# EAGLE design usb-wildcard-r2 (EAGLE 5.12)
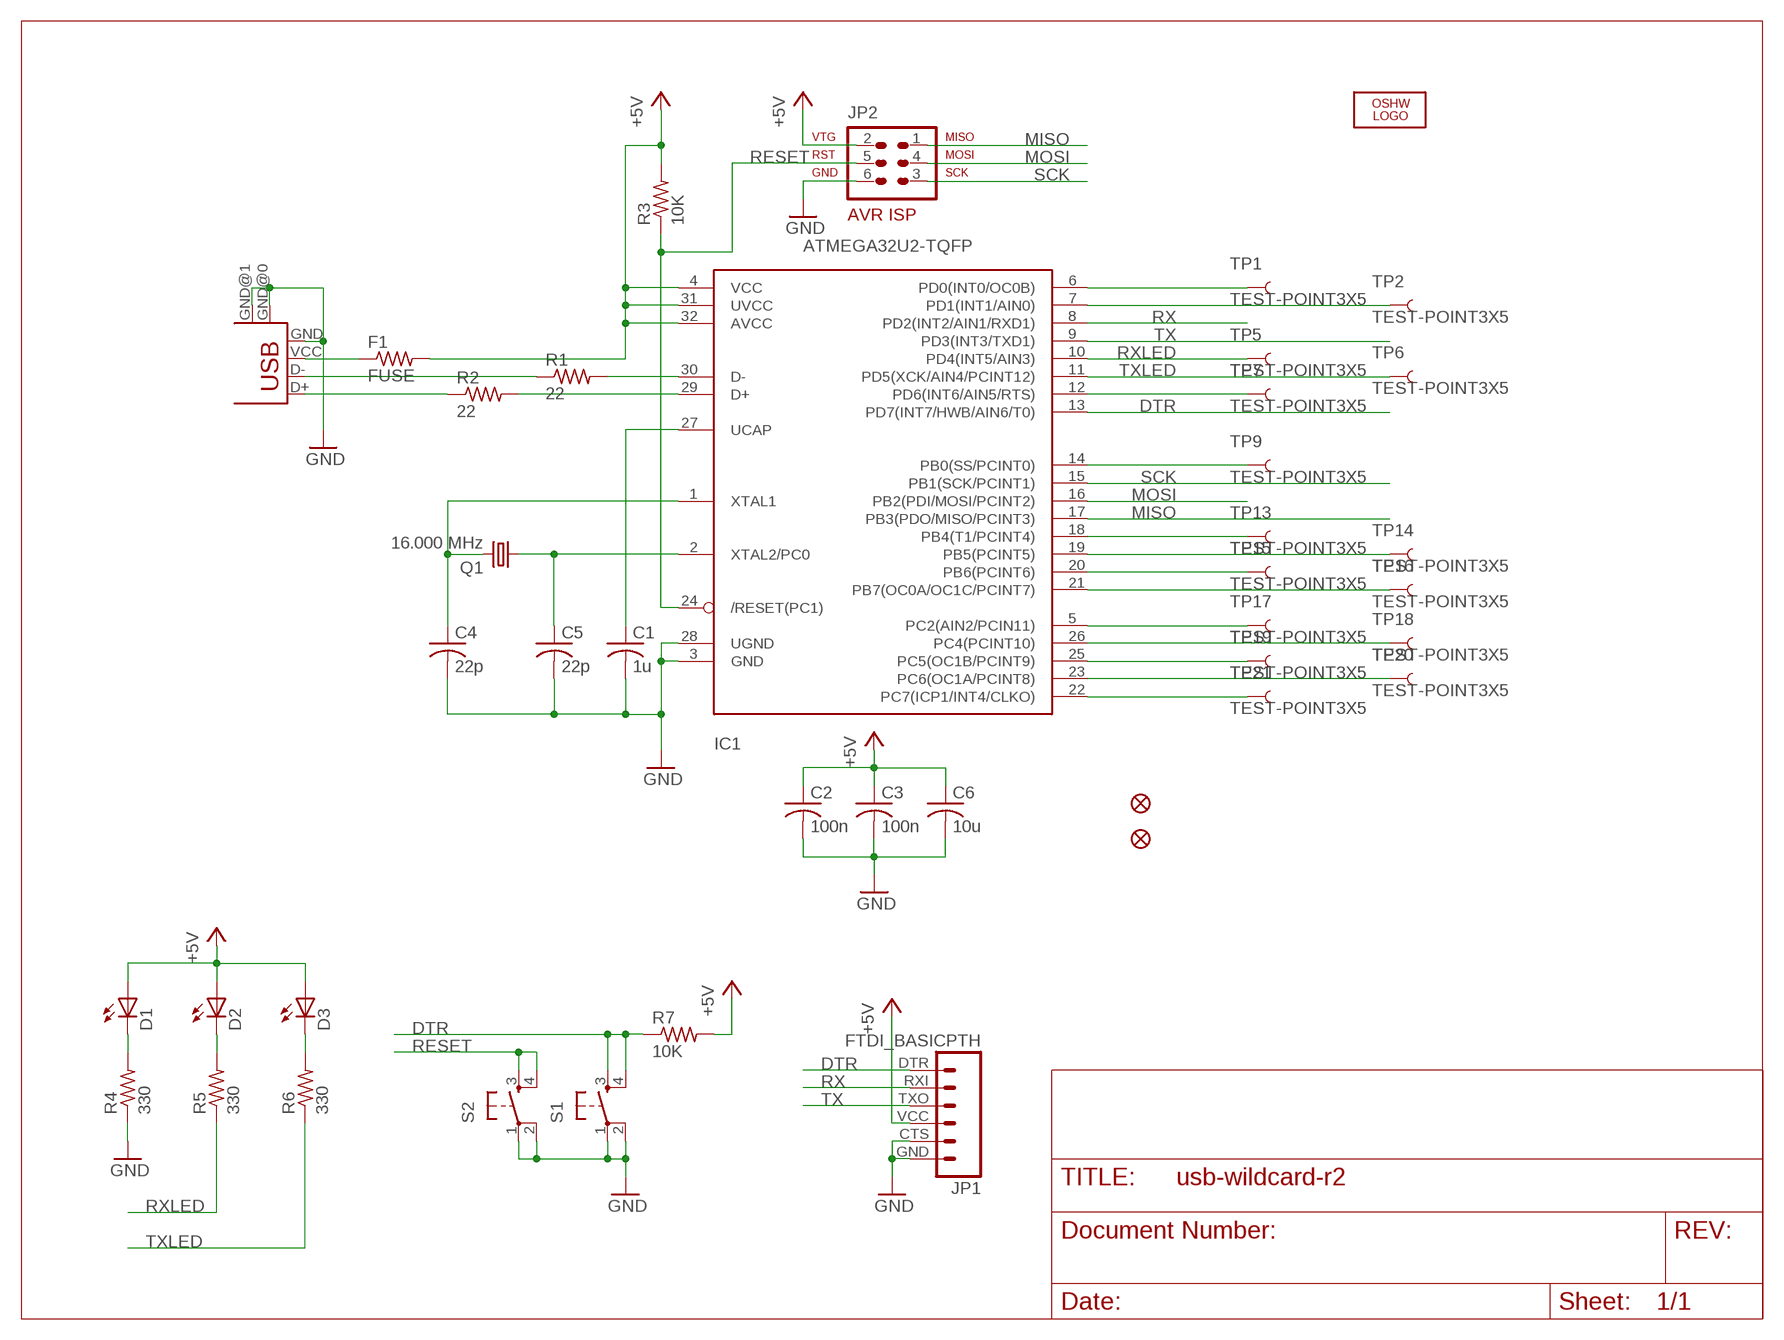
[diagram p0: schematic, sheet 1]

## Parts
C1  1u  C-USC0603  [C0603]
C2  100n  C-USC0603  [C0603]
C3  100n  C-USC0603  [C0603]
C4  22p  C-USC0603  [C0603]
C5  22p  C-USC0603  [C0603]
C6  10u  C-USC0603  [C0603]
D1  LEDCHIP-LED0603  [CHIP-LED0603]
D2  LEDCHIP-LED0603  [CHIP-LED0603]
D3  LEDCHIP-LED0603  [CHIP-LED0603]
F1  FUSE  R-US_R0603  [R0603]
IC1  ATMEGA32U2-TQFP  [TQFP32-08]
JP1  FTDI_BASICPTH  [FTDI_BASIC]
JP2  AVR-ISP-6  [AVR-ISP-6]
JP3  FIDUCIAL1X2.5  [FIDUCIAL-1X2.5]
JP4  FIDUCIAL1X2.5  [FIDUCIAL-1X2.5]
LOGO1  OSHW_LOGO_10MILX0200-NT  [OSHW_10X200_NOTEXT]
Q1  16.000 MHz  CRYSTALCTS406  [CTS406]
R1  22  R-US_R0603  [R0603]
R2  22  R-US_R0603  [R0603]
R3  10K  R-US_R0603  [R0603]
R4  330  R-US_R0603  [R0603]
R5  330  R-US_R0603  [R0603]
R6  330  R-US_R0603  [R0603]
R7  10K  R-US_R0603  [R0603]
S1  TAC_SWITCHSMD  [TACTILE_SWITCH_SMD]
S2  TAC_SWITCHSMD  [TACTILE_SWITCH_SMD]
TP1  TEST-POINT3X5  [PAD.03X.05]
TP2  TEST-POINT3X5  [PAD.03X.05]
TP5  TEST-POINT3X5  [PAD.03X.05]
TP6  TEST-POINT3X5  [PAD.03X.05]
TP7  TEST-POINT3X5  [PAD.03X.05]
TP9  TEST-POINT3X5  [PAD.03X.05]
TP13  TEST-POINT3X5  [PAD.03X.05]
TP14  TEST-POINT3X5  [PAD.03X.05]
TP15  TEST-POINT3X5  [PAD.03X.05]
TP16  TEST-POINT3X5  [PAD.03X.05]
TP17  TEST-POINT3X5  [PAD.03X.05]
TP18  TEST-POINT3X5  [PAD.03X.05]
TP19  TEST-POINT3X5  [PAD.03X.05]
TP20  TEST-POINT3X5  [PAD.03X.05]
TP21  TEST-POINT3X5  [PAD.03X.05]
USB1  USB-U  [USB-MICROB-ALI]

## Nets
+5V: C2.1 C3.1 C6.1 D1.A D2.A D3.A F1.2 IC1.4(VCC) IC1.31(UVCC) IC1.32(AVCC) JP1.VCC JP2.2 R3.2 R7.2
D+: R2.1 USB1.D+
D-: R1.1 USB1.D-
DTR: IC1.13(PD7(INT7/HWB/AIN6/T0)) JP1.DTR R7.1 S1.3 S1.4
GND: C1.2 C2.2 C3.2 C4.2 C5.2 C6.2 IC1.3(GND) IC1.28(UGND) JP1.CTS JP1.GND JP2.6 R4.1 S1.1 S1.2 S2.1 S2.2 USB1.GND USB1.GND@0(GND) USB1.GND@1(GND)
MISO: IC1.17(PB3(PDO/MISO/PCINT3)) JP2.1
MOSI: IC1.16(PB2(PDI/MOSI/PCINT2)) JP2.4
N$2: IC1.30(D-) R1.2
N$3: IC1.29(D+) R2.2
N$4: F1.1 USB1.VCC(VBUS)
N$8: C1.1 IC1.27(UCAP)
N$9: C4.1 IC1.1(XTAL1) Q1.3
N$10: C5.1 IC1.2(XTAL2/PC0) Q1.1
N$23: D1.C R4.2
N$24: D2.C R5.2
N$25: D3.C R6.2
PB0: IC1.14(PB0(SS/PCINT0)) TP9.P$1
PB4: IC1.18(PB4(T1/PCINT4)) TP13.P$1
PB5: IC1.19(PB5(PCINT5)) TP14.P$1
PB6: IC1.20(PB6(PCINT6)) TP15.P$1
PB7: IC1.21(PB7(OC0A/OC1C/PCINT7)) TP16.P$1
PC2: IC1.5(PC2(AIN2/PCIN11)) TP17.P$1
PC4: IC1.26(PC4(PCINT10)) TP18.P$1
PC5: IC1.25(PC5(OC1B/PCINT9)) TP19.P$1
PC6: IC1.23(PC6(OC1A/PCINT8)) TP20.P$1
PC7: IC1.22(PC7(ICP1/INT4/CLKO)) TP21.P$1
PD0: IC1.6(PD0(INT0/OC0B)) TP1.P$1
PD1: IC1.7(PD1(INT1/AIN0)) TP2.P$1
PD6: IC1.12(PD6(INT6/AIN5/RTS)) TP7.P$1
RESET: IC1.24(/RESET(PC1)) JP2.5 R3.1 S2.3 S2.4
RX: IC1.8(PD2(INT2/AIN1/RXD1)) JP1.RXI
RXLED: IC1.10(PD4(INT5/AIN3)) R5.1 TP5.P$1
SCK: IC1.15(PB1(SCK/PCINT1)) JP2.3
TX: IC1.9(PD3(INT3/TXD1)) JP1.TXO
TXLED: IC1.11(PD5(XCK/AIN4/PCINT12)) R6.1 TP6.P$1

## Library data of the parts
C1-C6 = rcl:C-US: CAPACITOR, American symbol
D1-D3 = led:LED: LED OSRAM: - CHIPLED LG R971, LG N971, LY N971, LG Q971, LY Q971, LO R971, LY R971 LH N974, LH R974 LS Q976, LO Q976, LY Q976 LO Q996 - Hyper CHIPLED LW Q18S LB Q993, LB Q99A, LB R99A - SideLED LS A670, LO A670, LY A670, LG A670, LP A670 LB A673, LV A673, LT A673, LW A673 LH A674 LY A675 LS A676, LA A676, LO A676, LY A676, LW A676 LS A679, LY A679, LG A679 - Hyper Micro SIDELED® LS Y876, LA Y876, LO Y876, LY Y876 LT Y87S - SmartLED LW L88C, LW L88S LB L89C, LB L89S, LG L890 LS L89K, LO L89K, LY L89K LS L896, LA L896, LO L896, LY L896 - TOPLED LS T670, LO T670, LY T670, LG T670, LP T670 LSG T670, LSP T670, LSY T670, LOP T670, LYG T670 LG T671, LOG T671, LSG T671 LB T673, LV T673, LT T673, LW T673 LH T674 LS T676, LA T676, LO T676, LY T676, LB T676, LH T676, LSB T676, LW T676 LB T67C, LV T67C, LT T67C, LS T67K, LO T67K, LY T67K, LW E67C LS E67B, LA E67B, LO E67B, LY E67B, LB E67C, LV E67C, LT E67C LW T67C LS T679, LY T679, LG T679 LS T770, LO T770, LY T770, LG T770, LP T770 LB T773, LV T773, LT T773, LW T773 LH T774 LS E675, LA E675, LY E675, LS T675 LS T776, LA T776, LO T776, LY T776, LB T776 LHGB T686 LT T68C, LB T68C - Hyper Mini TOPLED® LB M676 - Mini TOPLED Santana® LG M470 LS M47K, LO M47K, LY M47K Source: http://www.osram.convergy.de LUXEON: - LUMILED® LXK2-PW12-R00, LXK2-PW12-S00, LXK2-PW14-U00, LXK2-PW14-V00 LXK2-PM12-R00, LXK2-PM12-S00, LXK2-PM14-U00 LXK2-PE12-Q00, LXK2-PE12-R00, LXK2-PE12-S00, LXK2-PE14-T00, LXK2-PE14-U00 LXK2-PB12-K00, LXK2-PB12-L00, LXK2-PB12-M00, LXK2-PB14-N00, LXK2-PB14-P00, LXK2-PB14-Q00 LXK2-PR12-L00, LXK2-PR12-M00, LXK2-PR14-Q00, LXK2-PR14-R00 LXK2-PD12-Q00, LXK2-PD12-R00, LXK2-PD12-S00 LXK2-PH12-R00, LXK2-PH12-S00 LXK2-PL12-P00, LXK2-PL12-Q00, LXK2-PL12-R00 Source: www.luxeon.com KINGBRIGHT: KA-3528ASYC Source: www.kingbright.com
F1 R1-R7 = rcl:R-US_: RESISTOR, American symbol
IC1 = adafruit:ATMEGA32U2: ATmega32u2 Pin compatible with the atmega8u2, atmega16u2 and atmega32u2 8, 16 or 32 K flash, 1K RAM, 512b EEPROM 8 bit and 16 bit timer (5 PWM total) UART, SPI (no I2C!) USB with 4 endpoints, LUFA compatible 22 I/O lines, analog comparator (no ADC!) Comes with DFU bootloader burned in!
JP1 = SparkFun:FTDI_BASIC: FTDI Basic: 3.3V and 5V
JP2 = avr-5:AVR-ISP-6: AVR ISP-6 Serial Programming Header
JP3 JP4 = SparkFun:FIDUCIAL: Fiducial Alignment Points Various fiducial points for machine vision alignment.
LOGO1 = ohw-logo:OSHW_LOGO_10MIL
Q1 = crystal:CRYSTAL: CRYSTAL; OC_FARNELL: unknown; OC_NEWARK: unknown
S1 S2 = SparkFun:TAC_SWITCH: Momentary Switch Button commonly used for reset or general input. Spark Fun Electronics SKU : COM-00097
TP1 TP2 TP5-TP7 TP9 TP13-TP21 = SparkFun:TEST-POINT
USB1 = con-usb-2:USB: USB Connectors

## Board
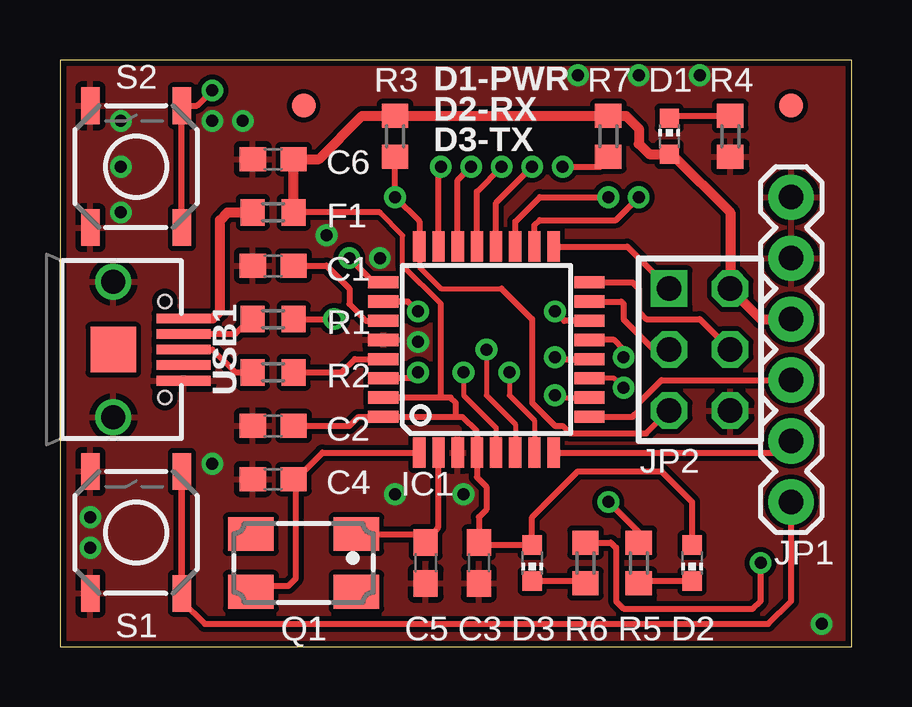
[diagram p1: board, top side]
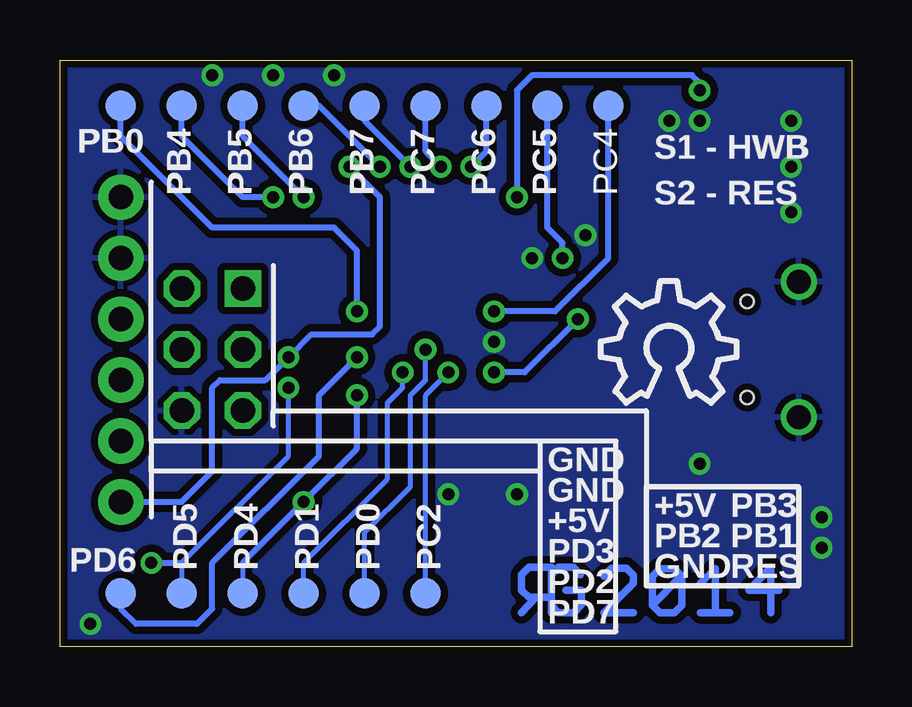
[diagram p2: board, bottom side, seen from below]

Size 33.02 x 24.45 mm. Coordinates in mm from the lower left corner, seen from the top.
Outline: 0,0 33.02,0 33.02,24.45 0,24.45 0,0
Copper layers (1*16): Top 0.035mm / dielectric 1.5mm / Bottom 0.035mm
Design rules "default *": minimum track width 8mil, minimum drill 19mil, track to track 8mil, track to pad 8mil, pad to pad 8mil, via to via 8mil, smd to smd 8mil, copper to edge 10mil, drill to drill 8mil, minimum pad ring 10mil, minimum via ring 8mil, stop-mask expansion 4mil, vias tented up to drill 20mil, thermal gap 10mil

### Footprints (pad centres in the part's own frame; a part is rotated, then mirrored left to right if it is on the bottom)
C0603 = smd 1.1 x 1: 1 -0.85,0; 2 0.85,0
CHIP-LED0603 = smd 0.8 x 0.8: A 0,-0.75; C 0,0.75
R0603 = smd 1 x 1.1: 1 -0.85,0; 2 0.85,0
TQFP32-08 = smd 1.27 x 0.508: 1 -4.293,2.8; 2 -4.293,2; 3 -4.293,1.2; 4 -4.293,0.4; 5 -4.293,-0.4; 6 -4.293,-1.2; 7 -4.293,-2; 8 -4.293,-2.8; 17 4.293,-2.8; 18 4.293,-2; 19 4.293,-1.2; 20 4.293,-0.4; 21 4.293,0.4; 22 4.293,1.2; 23 4.293,2; 24 4.293,2.8 | smd 0.508 x 1.27: 9 -2.8,-4.293; 10 -2,-4.293; 11 -1.2,-4.293; 12 -0.4,-4.293; 13 0.4,-4.293; 14 1.2,-4.293; 15 2,-4.293; 16 2.8,-4.293; 25 2.8,4.293; 26 2,4.293; 27 1.2,4.293; 28 0.4,4.293; 29 -0.4,4.293; 30 -1.2,4.293; 31 -2,4.293; 32 -2.8,4.293
FTDI_BASIC = drill 1.016 pad 1.88 round: CTS 10.16,0; DTR 0,0; GND 12.7,0; RXI 2.54,0; TXO 5.08,0; VCC 7.62,0
AVR-ISP-6 = drill 1.016 square: 1 -2.54,-1.27 | drill 1.016 octagon: 2 -2.54,1.27; 3 0,-1.27; 4 0,1.27; 5 2.54,-1.27; 6 2.54,1.27
FIDUCIAL-1X2.5 = smd 1 x 1: 1 0,0
CTS406 = smd 1.9 x 1.4: 1 -2.2,-1.2; 2 2.2,-1.2; 3 2.2,1.2; 4 -2.2,1.2
TACTILE_SWITCH_SMD = smd 1.524 x 0.762: 1 -2.54,1.905; 2 2.54,1.905; 3 -2.54,-1.905; 4 2.54,-1.905
PAD.03X.05 = smd 1.27 x 1.27: P$1 0,0
USB-MICROB-ALI = smd 0.4 x 2.25: D+ 0,2.925; D- -0.65,2.925; GND 1.3,2.925; ID 0.65,2.925; VCC -1.3,2.925 | drill 1 round: GND@0 -2.825,0; GND@1 2.825,0 | smd 1.9 x 1.9: GND@2 0,0 | hole 0.55: -2,2.15; 2,2.15

### Placement (x,y rotation side)
C1  8.89,15.88 180 top
C2  8.89,9.21 180 top
C3  17.46,3.49 270 top
C4  8.89,6.99 180 top
C5  15.24,3.49 270 top
C6  8.89,20.32 180 top
D1  25.4,21.27 0 top
D2  26.35,3.49 180 top
D3  19.68,3.49 180 top
F1  8.89,18.1 0 top
IC1  17.78,12.38 90 top
JP1  30.48,6.03 90 top
JP2  26.67,12.38 270 top
JP3  30.48,22.54 0 top
JP4  10.16,22.54 0 top
LOGO1  10.48,10.16 0 bottom
Q1  10.16,3.49 180 top
R1  8.89,13.65 0 top
R2  8.89,11.43 0 top
R3  13.97,21.27 90 top
R4  27.94,21.27 90 top
R5  24.13,3.49 270 top
R6  21.91,3.49 270 top
R7  22.86,21.27 90 top
S1  3.17,4.76 90 top
S2  3.17,20 90 top
TP1  20.32,2.22 0 bottom
TP2  22.86,2.22 0 bottom
TP5  25.4,2.22 0 bottom
TP6  27.94,2.22 0 bottom
TP7  30.48,2.22 0 bottom
TP9  30.48,22.54 0 bottom
TP13  27.94,22.54 0 bottom
TP14  25.4,22.54 0 bottom
TP15  22.86,22.54 0 bottom
TP16  20.32,22.54 0 bottom
TP17  17.78,2.22 0 bottom
TP18  10.16,22.54 0 bottom
TP19  12.7,22.54 0 bottom
TP20  15.24,22.54 0 bottom
TP21  17.78,22.54 0 bottom
U$1  [RGLOGO_SMALL_2014]  12.38,1.27 0 bottom
USB1  2.22,12.38 270 top

### Tracks (layer width: path | path; a pad name or v marks a point on that pad's centre or on a via)
+5V
  Top 0.203: 15.88,14.29 14.29,15.88 14.29,17.14 13.34,18.1
  Top 0.254: C2.1 12.06,9.21 12.44,9.58 IC1.32 16.51,9.58 | 16.51,9.58 16.77,9.58 17.38,8.97 IC1.4 17.38,7.07 17.78,6.67 17.78,5.71 17.46,5.4 C3.1 17.78,4.24 D3.A 19.68,5.4 21.59,7.3 25.08,7.3 26.35,6.03 D2.A | 15.88,10.38 16.29,10.38 16.51,10.16 16.51,9.58 | 15.88,10.38 IC1.31 | 13.34,18.1 F1.2 | 15.88,10.38 15.88,14.29
  Top 0.406: F1.2 C6.1 10.79,20.32 12.6,22.12 R3.2 R7.2 23.6,22.12 24.13,21.59 24.13,20.95 24.56,20.52 D1.A 25.52,20.52 27.94,18.1 JP2.2 29.21,13.65 JP1.VCC
D+
  Top 0.254: R2.1 7.3,11.43 6.35,12.38 USB1.D+
D-
  Top 0.254: R1.1 7.94,13.65 7.32,13.03 USB1.D-
DTR  (via drill 0.5)
  Top 0.254: IC1.13 23.09,12.78 23.5,12.38 v23.5,12.06 | S1.3 S1.4 5.08,1.91 6.03,0.95 29.53,0.95 30.48,1.91 JP1.DTR | R7.1 22.86,20.32 22.54,20 v20.95,20
  Bottom 0.254: JP1.DTR 27.94,6.03 26.67,7.3 26.67,10.79 26.35,11.11 24.45,11.11 v23.5,12.06 22.54,13.02 20,13.02 19.68,13.34 19.68,18.73 v20.95,20
GND  (via drill 0.5)
  other vias: 14.92,12.7 6.35,7.62 16.83,6.35 7.62,21.91 11.11,17.14 13.34,16.19 21.59,23.81 26.67,23.81 24.13,23.81 1.27,5.4 1.27,4.13 2.54,18.1 2.54,20 2.54,21.91 13.97,6.35 31.75,0.95 6.35,21.91
  pour Top: -1.27,26.35 34.29,26.35 34.29,-1.59 -1.27,-1.59
  pour Bottom (isolate 0.305): -1.27,26.35 34.29,26.35 34.29,-1.59 -1.27,-1.59
MISO
  Top 0.254: IC1.17 23.65,16.68 JP2.1
MOSI
  Top 0.254: IC1.16 23.87,15.18 24.13,14.92 24.13,13.97 24.45,13.65 26.67,13.65 JP2.4
N$2  (via drill 0.5)
  Top 0.254: IC1.30 14.68,11.18 v14.92,11.43 | R1.2 v11.43,13.65
  Bottom 0.254: v14.92,11.43 13.65,11.43 v11.43,13.65
N$3
  Top 0.254: R2.2 11.75,11.43 12.3,11.98 IC1.29
N$4
  Top 0.406: F1.1 6.99,18.1 6.67,17.78 6.67,13.97 6.38,13.68 USB1.VCC
N$8
  Top 0.254: IC1.27 12.77,13.58 12.06,14.29 12.06,14.92 11.11,15.88 C1.1
N$9
  Top 0.254: IC1.1 10.95,8.09 9.84,6.99 | 9.84,6.99 9.84,2.86 9.53,2.54 8.21,2.54 Q1.3 | 9.84,6.99 C4.1
N$10
  Top 0.254: IC1.2 15.78,4.98 C5.1 14.99,4.69 Q1.1
N$23
  Top 0.254: R4.2 25.5,22.12 D1.C
N$24
  Top 0.254: D2.C 24.13,2.74 R5.2
N$25
  Top 0.254: D3.C 21.81,2.74 R6.2
PB0  (via drill 0.5)
  Top 0.254: IC1.14 21.02,13.58 v20.64,13.97
  Bottom 0.254: v20.64,13.97 20.64,16.51 21.59,17.46 26.67,17.46 30.48,21.27 TP9.P$1
PB4  (via drill 0.5)
  Top 0.254: IC1.18 19.78,17.56 20,17.78 23.18,17.78 v24.13,18.73
  Bottom 0.254: v24.13,18.73 25.4,18.73 27.94,21.27 TP13.P$1
PB5  (via drill 0.5)
  Top 0.254: IC1.19 18.98,17.71 20,18.73 v22.86,18.73
  Bottom 0.254: v22.86,18.73 25.4,21.27 TP14.P$1
PB6  (via drill 0.5)
  Top 0.254: IC1.20 18.18,18.5 v19.68,20
  Bottom 0.254: TP15.P$1 22.23,22.54 v19.68,20
PB7  (via drill 0.5)
  Top 0.254: IC1.21 17.38,18.97 v18.41,20
  Bottom 0.254: TP16.P$1 20.32,21.91 v18.41,20
PC2  (via drill 0.5)
  Top 0.203: v16.83,11.43 16.83,10.48 18.18,9.12 IC1.5
  Bottom 0.203: TP17.P$1 17.78,10.48 v16.83,11.43
PC4  (via drill 0.5)
  Top 0.254: IC1.26 14.51,14.38 v14.92,13.97
  Bottom 0.254: v14.92,13.97 12.38,13.97 10.16,16.19 TP18.P$1
PC5  (via drill 0.5)
  Top 0.254: IC1.25 13.07,15.18 v12.06,16.19
  Bottom 0.254: v12.06,16.19 12.06,16.83 12.7,17.46 TP19.P$1
PC6  (via drill 0.5)
  Top 0.254: IC1.23 15.78,19.91 v15.88,20
  Bottom 0.254: TP20.P$1 15.24,20.64 v15.88,20
PC7  (via drill 0.5)
  Top 0.254: IC1.22 16.58,19.44 v17.14,20
  Bottom 0.254: TP21.P$1 17.78,20.64 v17.14,20
PD0  (via drill 0.5)
  Top 0.203: v17.78,12.38 17.78,10.48 18.98,9.28 IC1.6
  Bottom 0.203: TP1.P$1 20.32,4.76 18.41,6.67 18.41,10.48 17.78,11.11 v17.78,12.38
PD1  (via drill 0.5)
  Top 0.203: IC1.7 19.78,9.43 18.73,10.48 v18.73,11.43
  Bottom 0.203: v18.73,11.43 18.73,10.79 19.37,10.16 19.37,6.99 22.86,3.49 TP2.P$1
PD6  (via drill 0.5)
  Top 0.254: IC1.12 20.72,11.98 v20.64,12.06
  Bottom 0.254: v20.64,12.06 22.23,10.48 22.23,7.94 26.67,3.49 26.67,1.59 27.3,0.95 29.84,0.95 30.48,1.59 TP7.P$1
RESET  (via drill 0.5)
  Top 0.203: 18.41,14.92 15.88,14.92 14.98,15.82 IC1.24
  Top 0.254: JP2.5 24.45,8.89 21.27,8.89 20.95,9.21 20.64,9.21 19.68,10.16 19.68,13.65 18.41,14.92 | S2.3 S2.4 5.71,22.54 v6.35,23.18 | R3.1 v13.97,18.73 14.98,17.72 IC1.24
  Bottom 0.254: v6.35,23.18 6.35,23.5 6.67,23.81 13.34,23.81 13.97,23.18 v13.97,18.73
RX
  Top 0.254: IC1.8 30,8.09 JP1.RXI
RXLED  (via drill 0.5)
  Top 0.203: IC1.10 20.73,10.38 v20.64,10.48
  Top 0.254: v22.86,6.03 24.13,4.76 R5.1
  Bottom 0.203: 25.4,3.49 TP5.P$1
  Bottom 0.254: v20.64,10.48 20.64,8.26 v22.86,6.03 25.4,3.49
SCK
  Top 0.254: JP2.3 24.77,12.38 23.5,13.65 23.5,14.29 23.4,14.38 IC1.15
TX
  Top 0.254: IC1.9 23.87,9.58 24.13,9.84 24.13,10.16 25.08,11.11 JP1.TXO
TXLED  (via drill 0.5)
  Top 0.203: IC1.11 23.11,11.18 v23.5,10.79
  Top 0.254: v29.21,3.49 29.21,1.91 28.89,1.59 23.5,1.59 23.18,1.91 23.18,4.13 22.96,4.34 R6.1
  Bottom 0.203: v23.5,10.79 23.5,7.94 27.94,3.49 TP6.P$1
  Bottom 0.254: v29.21,3.49 27.94,3.49

### Text on the board
tNames: D1-PWR | D2-RX | D3-TX
bNames: PC4 | PC5 | PC6 | PC7 | PB7 | PB6 | PB5 | PB4 | PB0 | S1 - HWB | S2 - RES | GND | GND | PB3 | +5V | +5V | PB1 | PB2 | PD6 | RES | GND | PD3 | PC2 | PD0 | PD1 | PD4 | PD5 | PD2 | PD7
_tsilk: S2 | R3 | R7 | D1 | R4 | D1-PWR | D2-RX | D3-TX | C6 | F1 | C1 | USB1 | R1 | R2 | C2 | JP2 | IC1 | C4 | JP1 | S1 | Q1 | C5 | C3 | D3 | R6 | R5 | D2
_bsilk: PC4 | PC5 | PC6 | PC7 | PB7 | PB6 | PB5 | PB4 | PB0 | S1 - HWB | S2 - RES | GND | GND | PB3 | +5V | +5V | PB1 | PB2 | PD6 | RES | GND | PD3 | PC2 | PD0 | PD1 | PD4 | PD5 | PD2 | PD7